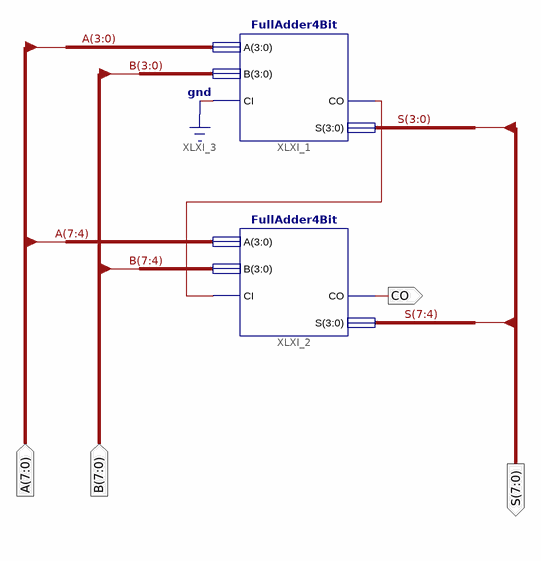
[diagram p0: schematic sheet 1]
// Xilinx ISE schematic FullAdder8Bit.sch (spartan6) as structural Verilog: 2 symbols, 4 ports
module FullAdder8Bit (
  input  [7:0] A,
  input  [7:0] B,
  output [7:0] S,
  output CO
);

  wire XLXN_1;

  FullAdder4Bit XLXI_1 (.A(A[3:0]), .B(B[3:0]), .CI(1'b0), .S(S[3:0]), .CO(XLXN_1));
  FullAdder4Bit XLXI_2 (.A(A[7:4]), .B(B[7:4]), .CI(XLXN_1), .S(S[7:4]), .CO(CO));
endmodule
